# Altium schematic sheet Sheet1 - backup.SchDoc
size A; SheetNumber: 1; SheetTotal: 1
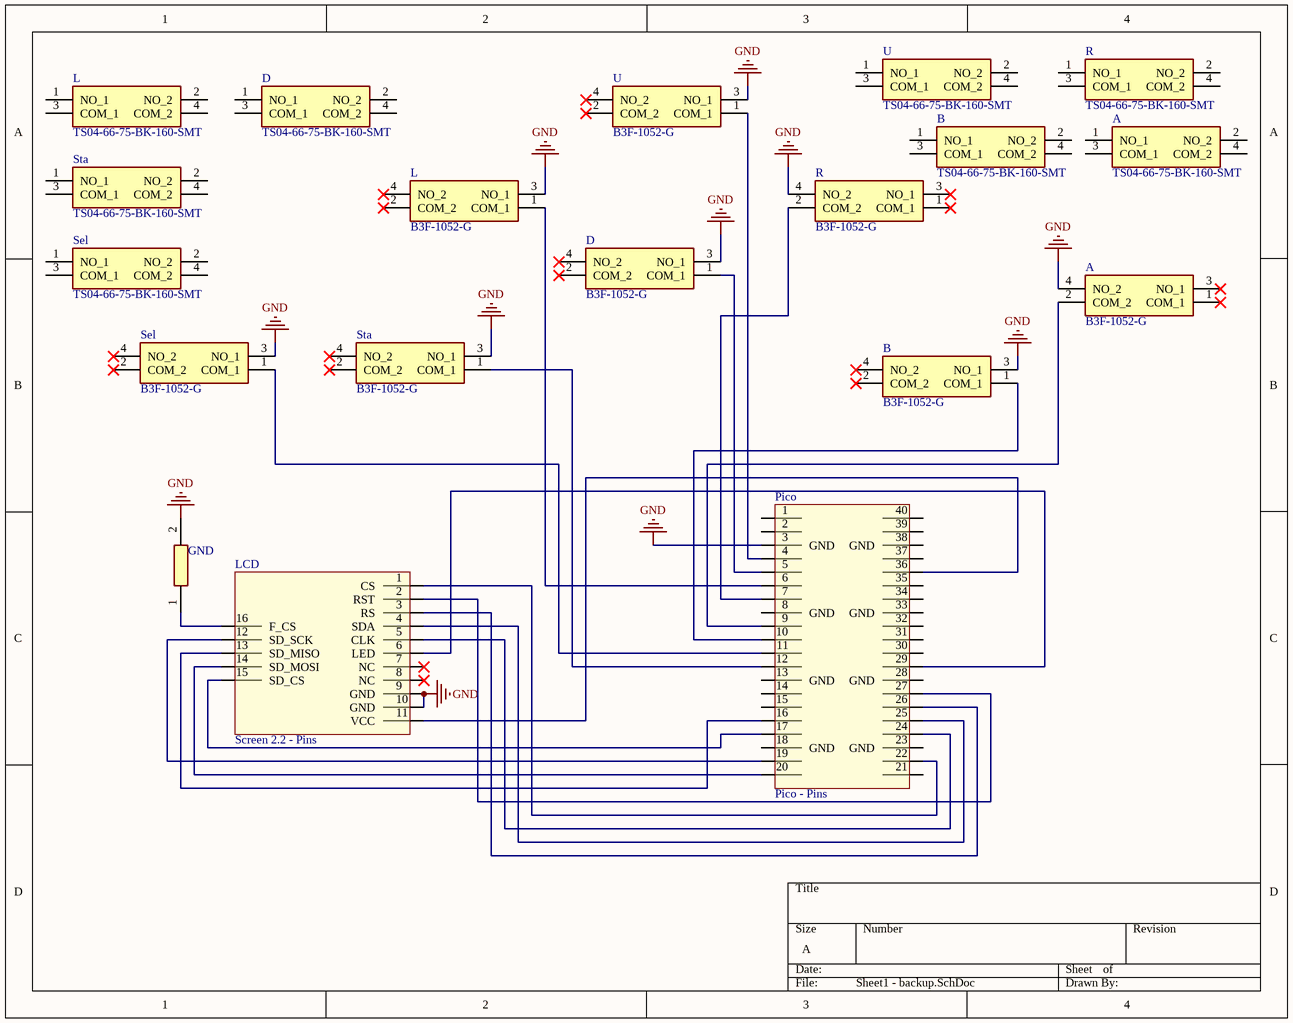
[diagram p0: Sheet1 - backup.SchDoc]

## Parts
(Parts that share a designator on the sheet are numbered #1, #2 ... from top to bottom, then left to right.)
A#1  TS04-66-75-BK-160-SMT  [TS046675BK160SMT]
A#2  B3F-1052-G  [B3F1052G]
B#1  TS04-66-75-BK-160-SMT  [TS046675BK160SMT]
B#2  B3F-1052-G  [B3F1052G]
D#1  TS04-66-75-BK-160-SMT  [TS046675BK160SMT]
D#2  B3F-1052-G  [B3F1052G]
GND  RA73F2A10KBTDF  [RESC2012X58N]  (value not drawn)
L#1  TS04-66-75-BK-160-SMT  [TS046675BK160SMT]
L#2  B3F-1052-G  [B3F1052G]
LCD  Screen 2.2 - Pins  [LCD 2.2'']
Pico  Pico - Pins  [Pico]
R#1  TS04-66-75-BK-160-SMT  [TS046675BK160SMT]
R#2  B3F-1052-G  [B3F1052G]
Sel#1  TS04-66-75-BK-160-SMT  [TS046675BK160SMT]
Sel#2  B3F-1052-G  [B3F1052G]
Sta#1  TS04-66-75-BK-160-SMT  [TS046675BK160SMT]
Sta#2  B3F-1052-G  [B3F1052G]
U#1  TS04-66-75-BK-160-SMT  [TS046675BK160SMT]
U#2  B3F-1052-G  [B3F1052G]

## Nets
GND: A#2.4(NO_2) B#2.3(NO_1) D#2.3(NO_1) GND.2 L#2.3(NO_1) LCD.9(GND) LCD.10(GND) Pico.3(GND) R#2.4(NO_2) Sel#2.3(NO_1) Sta#2.3(NO_1) U#2.3(NO_1)
NetA#2_2: A#2.2(COM_2) Pico.9
NetB#2_1: B#2.1(COM_1) Pico.10
NetD#2_1: D#2.1(COM_1) Pico.5
NetGND_1: GND.1 LCD.16(F_CS)
NetL#2_1: L#2.1(COM_1) Pico.6
NetLCD_1: LCD.1(CS) Pico.22
NetLCD_2: LCD.2(RST) Pico.27
NetLCD_3: LCD.3(RS) Pico.26
NetLCD_4: LCD.4(SDA) Pico.25
NetLCD_5: LCD.5(CLK) Pico.24
NetLCD_6: LCD.6(LED) Pico.29
NetLCD_11: LCD.11(VCC) Pico.36
NetLCD_12: LCD.12(SD_SCK) Pico.19
NetLCD_13: LCD.13(SD_MISO) Pico.16
NetLCD_14: LCD.14(SD_MOSI) Pico.20
NetLCD_15: LCD.15(SD_CS) Pico.17
NetPico_4: Pico.4 U#2.1(COM_1)
NetPico_7: Pico.7 R#2.2(COM_2)
NetPico_11: Pico.11 Sel#2.1(COM_1)
NetPico_12: Pico.12 Sta#2.1(COM_1)

Not connected (* = marked no-connect by the designer): A#1 1(NO_1) 2(NO_2) 3(COM_1) 4(COM_2); A#2 1(COM_1)* 3(NO_1)*; B#1 1(NO_1) 2(NO_2) 3(COM_1) 4(COM_2); B#2 2(COM_2)* 4(NO_2)*; D#1 1(NO_1) 2(NO_2) 3(COM_1) 4(COM_2); D#2 2(COM_2)* 4(NO_2)*; L#1 1(NO_1) 2(NO_2) 3(COM_1) 4(COM_2); L#2 2(COM_2)* 4(NO_2)*; LCD 7(NC)* 8(NC)*; Pico 1(22) 2 8(GND) 13(GND) 14 15 18(GND) 21(40) 23(GND) 28(GND) 30(31) 31(30) 32(29) 33(GND) 34(27) 35(26) 37(24) 38(GND) 39(22) 40(21); R#1 1(NO_1) 2(NO_2) 3(COM_1) 4(COM_2); R#2 1(COM_1)* 3(NO_1)*; Sel#1 1(NO_1) 2(NO_2) 3(COM_1) 4(COM_2); Sel#2 2(COM_2)* 4(NO_2)*; Sta#1 1(NO_1) 2(NO_2) 3(COM_1) 4(COM_2); Sta#2 2(COM_2)* 4(NO_2)*; U#1 1(NO_1) 2(NO_2) 3(COM_1) 4(COM_2); U#2 2(COM_2)* 4(NO_2)*

## Library data of the parts
A#1 B#1 D#1 L#1 R#1 Sel#1 Sta#1 U#1 = TS04-66-75-BK-160-SMT: Integrated Circuit; Manufacturer_Name: CUI Devices; Datasheet Link: https://www.mouser.es/ProductDetail/CUI-Devices/TS04-66-75-BK-160-SMT?qs=A6eO%252BMLsxmR5CIauYOve0Q%3D%3D; Height: 7.8mm; Manufacturer_Part_Number: TS04-66-75-BK-160-SMT; Mouser Part Number: 179-TS046675BK160SMT; Mouser Price/Stock: https://www.mouser.co.uk/ProductDetail/CUI-Devices/TS04-66-75-BK-160-SMT?qs=A6eO%252BMLsxmR5CIauYOve0Q%3D%3D; Arrow Part Number: TS04-66-75-BK-160-SMT; Arrow Price/Stock: https://www.arrow.com/en/products/ts04-66-75-bk-160-smt/cui-devices?region=nac
A#2 B#2 D#2 L#2 R#2 Sel#2 Sta#2 U#2 = B3F-1052-G: Switch; Manufacturer_Name: Omron Electronics; Datasheet Link: https://www.mouser.de/datasheet/2/307/omron_omrn-s-a0001309768-1-1770870.pdf; Height: 7.5mm; Manufacturer_Part_Number: B3F-1052-G; Mouser Part Number: 653-B3F-1052-G; Mouser Price/Stock: https://www.mouser.co.uk/ProductDetail/Omron-Electronics/B3F-1052-G?qs=82jvyl5dHWcDgqEfj%2F9YaA%3D%3D
GND = RA73F2A10KBTDF: Resistor; Manufacturer_Name: TE Connectivity; Datasheet Link: https://www.mouser.in/datasheet/2/418/8/ENG_DS_1773270_3_A-2899722.pdf; Height: 0.58mm; Manufacturer_Part_Number: RA73F2A10KBTDF; Mouser Part Number: 279-RA73F2A10KBTDF; Mouser Price/Stock: https://www.mouser.co.uk/ProductDetail/TE-Connectivity-Holsworthy/RA73F2A10KBTDF?qs=Li%252BoUPsLEntqleNaLrqoUg%3D%3D